# EAGLE design DRV8411A Module Rev. A (EAGLE 9.6.2)
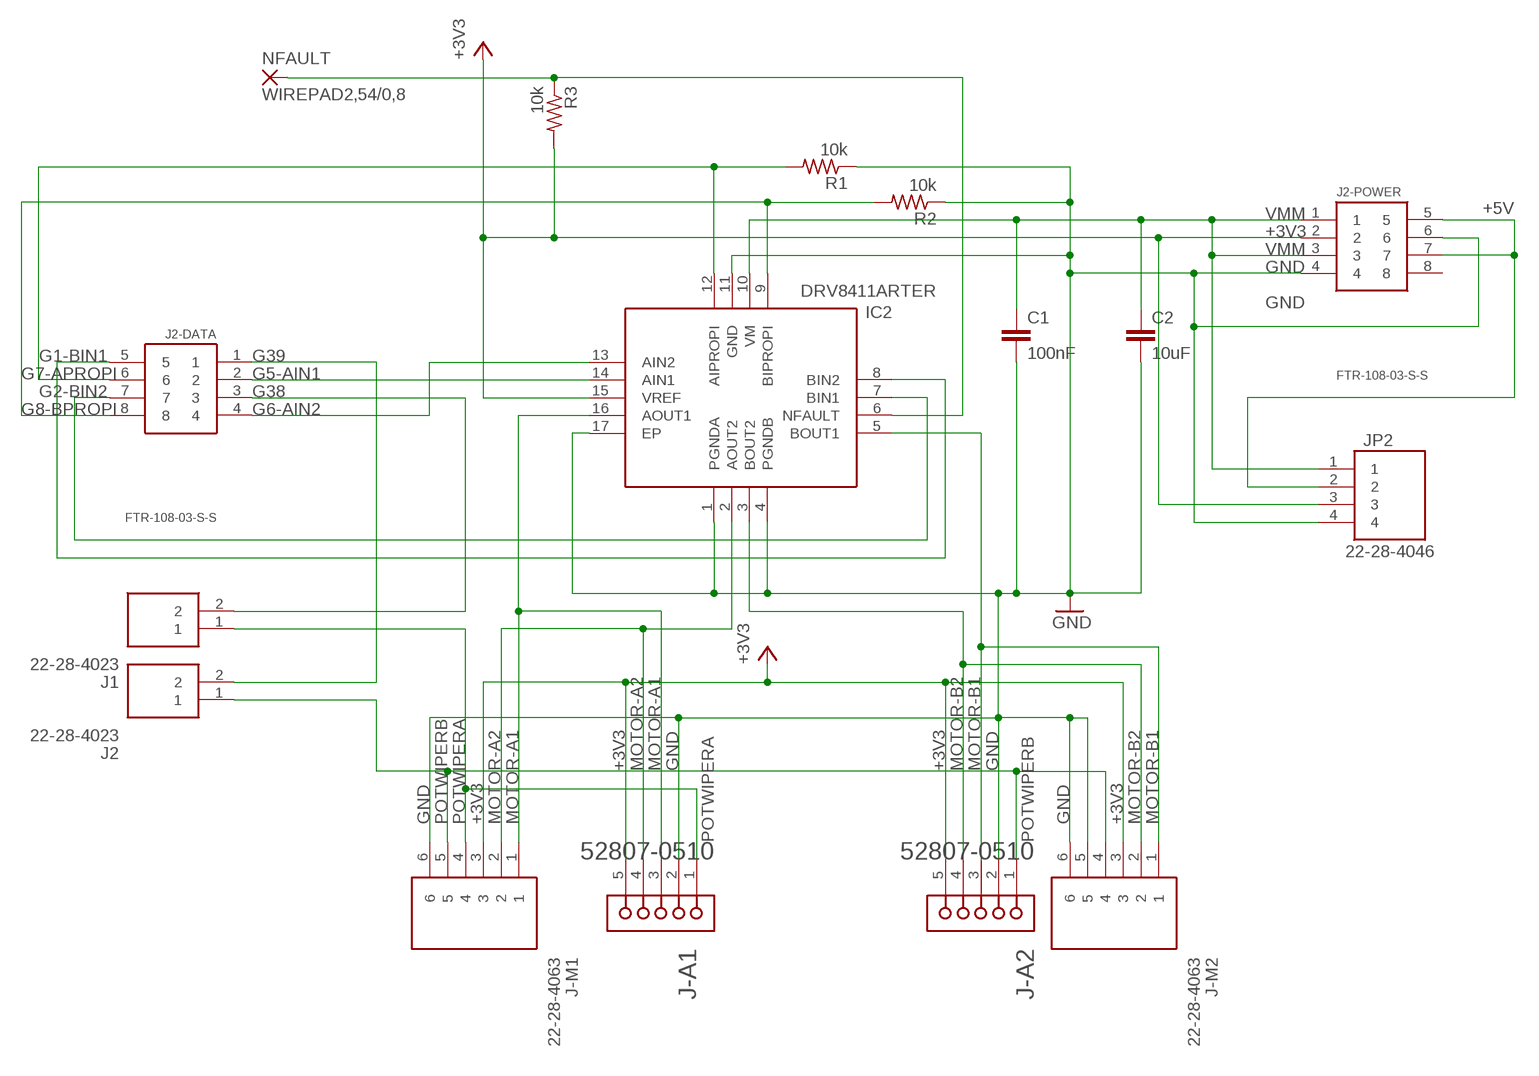
[diagram p0: schematic, sheet 1]

## Parts
C1  100nF  C-EUC0603  [C0603]
C2  10uF  C-EUC1206  [C1206]
IC2  DRV8411ARTER  [QFN50P300X300X80-17N]
J1  22-28-4023  [HDRV2W87P0X254_1X2_508X249X863]
J2  22-28-4023  [HDRV2W87P0X254_1X2_508X249X863]
J2-DATA  FTR-108-03-S-S  [HUSRSP8W46P127_1016X248X572P]
J2-POWER  FTR-108-03-S-S  [HUSRSP8W46P127_1016X248X572P]
J-A1  MOLEX_52807-0510MOLEX_52807-0510_0_0  [MOLEX_52807-0510_0]
J-A2  MOLEX_52807-0510MOLEX_52807-0510_0_0  [MOLEX_52807-0510_0]
J-M1  22-28-4063  [HDRV6W66P0X254_1X6_1524X249X83]
J-M2  22-28-4063  [HDRV6W66P0X254_1X6_1524X249X83]
JP2  22-28-4046  [HDRV4W66P0X254_1X4_1016X249X83]
NFAULT  WIREPAD2,54/0,8  [2,54/0,8]
R1  10k  R-US_R1206  [R1206]
R2  10k  R-US_R1206  [R1206]
R3  10k  R-US_R1206  [R1206]

## Nets
+3V3: IC2.15(VREF) J2-POWER.2 J-A1.5 J-A2.5 J-M1.3 J-M2.3 JP2.3 R3.2
+5V: J2-POWER.5 J2-POWER.7 JP2.2
G1-BIN1: IC2.8(BIN2) J2-DATA.5
G2-BIN2: IC2.7(BIN1) J2-DATA.7
G5-AIN1: IC2.14(AIN1) J2-DATA.2
G6-AIN2: IC2.13(AIN2) J2-DATA.4
G7-APROPI: IC2.12(AIPROPI) J2-DATA.6 R1.2
G8-BPROPI: IC2.9(BIPROPI) J2-DATA.8 R2.2
G38: J1.2 J2-DATA.3
G39: J2-DATA.1 J2.2
GND: C1.2 C2.2 IC2.1(PGNDA) IC2.4(PGNDB) IC2.11(GND) IC2.17(EP) J2-POWER.4 J2-POWER.6 J-A1.2 J-A2.2 J-M1.6 J-M2.5 J-M2.6 JP2.4 R1.1 R2.1
MOTOR-A1: IC2.16(AOUT1) J-A1.3 J-M1.1
MOTOR-A2: IC2.2(AOUT2) J-A1.4 J-M1.2
MOTOR-B1: IC2.5(BOUT1) J-A2.3 J-M2.1
MOTOR-B2: IC2.3(BOUT2) J-A2.4 J-M2.2
NFAULT: IC2.6(NFAULT) NFAULT.1(P) R3.1
POTWIPERA: J1.1 J-A1.1 J-M1.4
POTWIPERB: J2.1 J-A2.1 J-M1.5 J-M2.4
VMM [Power]: C1.1 C2.1 IC2.10(VM) J2-POWER.1 J2-POWER.3 JP2.1
Unconnected: J2-POWER.8

## Library data of the parts
C1 C2 = rcl:C-EU: CAPACITOR, European symbol; SPICEPREFIX: C
IC2 = SamacSys_Parts:DRV8411ARTER: Motor / Motion / Ignition Controllers & Drivers 1.65-V to 11-V, 4-A dual H-bridge motor driver with IPROPI current regulation Source: Datasheet <https://www.ti.com/product/DRV8411A/part-details/DRV8411ARTER>; DESCRIPTION: Motor / Motion / Ignition Controllers & Drivers 1.65-V to 11-V, 4-A dual H-bridge motor driver with IPROPI current regulation; HEIGHT: 0.8mm; MANUFACTURER_NAME: Texas Instruments; MANUFACTURER_PART_NUMBER: DRV8411ARTER; MOUSER_PART_NUMBER: 595-DRV8411ARTER; MOUSER_PRICE-STOCK: https://www.mouser.co.uk/ProductDetail/Texas-Instruments/DRV8411ARTER?qs=Jm2GQyTW%2FbhTQDH4ldRJVg%3D%3D
J1 J2 = SamacSys_Parts:22-28-4023: Molex KK 254 42375, 2.54mm Pitch, 2 Way, 1 Row Unshrouded, Straight Pin Header, Through Hole, Solder Termination Source: Datasheet <http://www.molex.com/molex/products/datasheet.jsp?part=active/0022284023_PCB_HEADERS.xml>; DESCRIPTION: Molex KK 254 42375, 2.54mm Pitch, 2 Way, 1 Row Unshrouded, Straight Pin Header, Through Hole, Solder Termination; HEIGHT: 8.63mm; MANUFACTURER_NAME: Molex; MANUFACTURER_PART_NUMBER: 22-28-4023; MOUSER_PART_NUMBER: 538-22-28-4023; MOUSER_PRICE-STOCK: https://www.mouser.co.uk/ProductDetail/Molex/22-28-4023?qs=MuwpYaHj750gid5X5P2KgQ%3D%3D
J2-DATA J2-POWER = SamacSys_Parts:FTR-108-03-S-S: CONN HEADER SMD 8 POS 1.27MM Source: Datasheet <http://suddendocs.samtec.com/catalog_english/ftr_smt.pdf>; DESCRIPTION: CONN HEADER SMD 8 POS 1.27MM; HEIGHT: mm; MANUFACTURER_NAME: SAMTEC; MANUFACTURER_PART_NUMBER: FTR-108-03-S-S
J-A1 J-A2 = Molex - 52807-0510:MOLEX_52807-0510: MOLX-52807-0510; CIIVA_IDS: 3407603; CIRCUITS_LOADED: 5; COMPONENT_LINK_1_DESCRIPTION: Manufacturer URL; COMPONENT_LINK_1_URL: http://www.molex.com/molex/index.jsp; COMPONENT_LINK_3_DESCRIPTION: Package Specification; COMPONENT_LINK_3_URL: http://www.molex.com/pdm_docs/sd/528070510_sd.pdf; CONTACT_POSITION: Top; CURRENT_MAX_PER_CONTACT: 0.2A, 0.4A, 0.5A; DATASHEET: http://www.molex.com/webdocs/datasheets/pdf/en-us/0528070510_FFC_FPC_CONNECTORS.pdf; ENTRY_ANGLE: 90degrees Angle; FOOTPRINT_VARIANT_NAME_0: Manufacturer Recommended; IMPORTED: yes; IMPORTED_FROM: vault; IMPORT_TS: 1521841804; MATED_HEIGHT: 3.60mm; MATERIAL___METAL: Phosphor Bronze; MATERIAL___PLATING_MATING: Tin; MATERIAL___PLATING_TERMINATION: Tin; MF: Molex; MOUNTING_TECHNOLOGY: Through Hole; MPN: 52807-0510; NUMBER_OF_ROWS: 1; ORIENTATION: Right Angle; PACKAGE: 52807-0510; PACKAGE_DESCRIPTION: 5-Lead FFC Connector, Pitch 1.0 mm; PACKAGE_VERSION: Rev. B, 08/2002; PACKING: Tray; PCB_RETENTION: None; PITCH___MATING_INTERFACE: 1.00mm; PITCH___TERMINATION_INTERFACE: 1.00mm; POLARIZED_TO_PCB: Yes; PREFIX: J; RELEASE_DATE: 1411372626; ROHS: Yes; STACKABLE: No; VAULT_GUID: C91CB896-1E32-4DB6-8F6C-FD3BFAFEC20D; VAULT_REVISION: BD038269-A002-43D0-B0A9-6B73FA1A6DCF; VOLTAGE_MAX: 50V
J-M1 J-M2 = SamacSys_Parts:22-28-4063: Headers & Wire Housings BREAKAWAY HDR VERT 6 Source: Datasheet <https://www.molex.com/pdm_docs/sd/022284063_sd.pdf>; DESCRIPTION: Headers & Wire Housings BREAKAWAY HDR VERT 6; HEIGHT: 8.38mm; MANUFACTURER_NAME: Molex; MANUFACTURER_PART_NUMBER: 22-28-4063; MOUSER_PART_NUMBER: 538-22-28-4063; MOUSER_PRICE-STOCK: https://www.mouser.co.uk/ProductDetail/Molex/22-28-4063?qs=MuwpYaHj750CQ%2FtWum2FiQ%3D%3D
JP2 = SamacSys_Parts:22-28-4046: Headers & Wire Housings 2.54MM HDR VT 4P 240/125 30AU Source: Datasheet <https://componentsearchengine.com/Datasheets/1/22-28-4046.pdf>; DESCRIPTION: Headers & Wire Housings 2.54MM HDR VT 4P 240/125 30AU; HEIGHT: 8.38mm; MANUFACTURER_NAME: Molex; MANUFACTURER_PART_NUMBER: 22-28-4046; MOUSER_PART_NUMBER: 538-22-28-4046; MOUSER_PRICE-STOCK: https://www.mouser.co.uk/ProductDetail/Molex/22-28-4046?qs=GAPJcf4kvdtZsXSzVDpHFw%3D%3D
NFAULT = wirepad:WIREPAD: Wire PAD connect wire on PCB
R1-R3 = rcl:R-US_: RESISTOR, American symbol; SPICEPREFIX: R

## Net classes
2 Power: width 0.203 mm

## Board
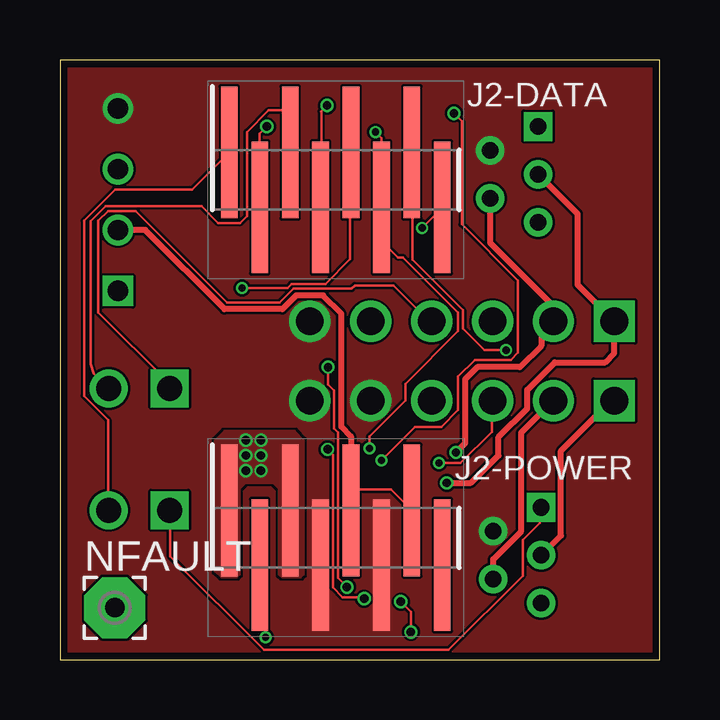
[diagram p1: board, top side]
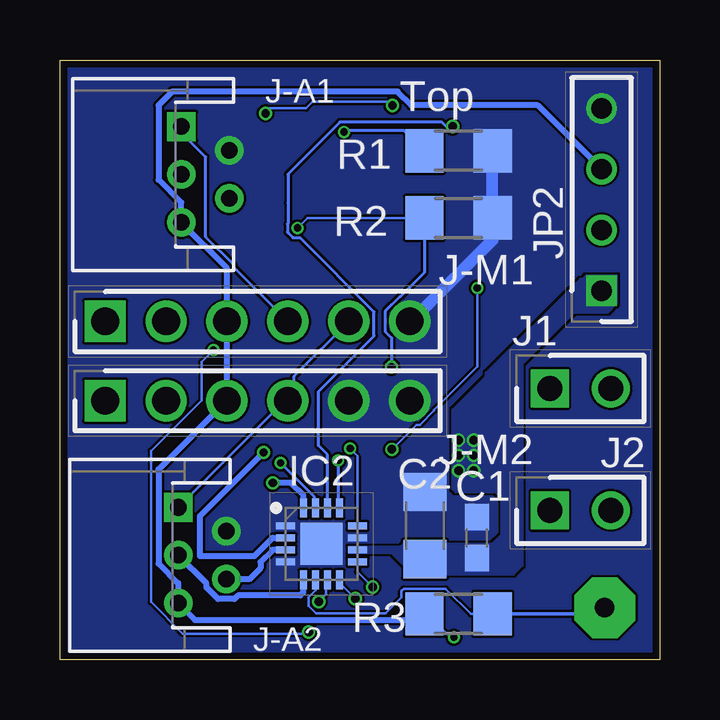
[diagram p2: board, bottom side, seen from below]

Size 25 x 25 mm. Coordinates in mm from the lower left corner, seen from the top.
Outline: 0,0 25,0 25,25 0,25 0,0
Copper layers (1*16): Top 0.035mm / dielectric 1.5mm / Bottom 0.035mm
Design rules "PCBWay_2L_100um-Track": minimum track width 0.1mm, minimum drill 0.3mm, track to track 0.1mm, track to pad 0.1mm, pad to pad 0.1mm, via to via 0.1mm, smd to smd 0mil, copper to edge 0.3mm, drill to drill 10mil, minimum pad ring 6mil, minimum via ring 0.1mm, stop-mask expansion 2mil, vias tented up to drill 0.45mm, thermal gap 0.2mm

### Footprints (pad centres in the part's own frame; a part is rotated, then mirrored left to right if it is on the bottom)
C0603 = smd 1.1 x 1: 1 -0.85,0; 2 0.85,0
C1206 = smd 1.6 x 1.8: 1 -1.4,0; 2 1.4,0
QFN50P300X300X80-17N = smd 0.8 x 0.3: 1 -1.5,0.75; 2 -1.5,0.25; 3 -1.5,-0.25; 4 -1.5,-0.75; 9 1.5,-0.75; 10 1.5,-0.25; 11 1.5,0.25; 12 1.5,0.75 | smd 0.3 x 0.8: 5 -0.75,-1.5; 6 -0.25,-1.5; 7 0.25,-1.5; 8 0.75,-1.5; 13 0.75,1.5; 14 0.25,1.5; 15 -0.25,1.5; 16 -0.75,1.5 | smd 1.76 x 1.76: 17 0,0
HDRV2W87P0X254_1X2_508X249X863 = drill 1.05 pad 1.575 square: 1 0,0 | drill 1.05 pad 1.575: 2 2.54,0
HUSRSP8W46P127_1016X248X572P = smd 0.69 x 5.49: 1 -4.445,1.142; 2 -3.175,-1.142; 3 -1.905,1.142; 4 -0.635,-1.142; 5 0.635,1.142; 6 1.905,-1.142; 7 3.175,1.142; 8 4.445,-1.142
MOLEX_52807-0510_0 = drill 0.7 pad 1.2 square: 1 0,0 | drill 0.7 pad 1.2: 2 1,2; 3 2,0; 4 3,2; 5 4,0
HDRV6W66P0X254_1X6_1524X249X83 = drill 1.15 pad 1.725 square: 1 0,0 | drill 1.15 pad 1.725: 2 2.54,0; 3 5.08,0; 4 7.62,0; 5 10.16,0; 6 12.7,0
HDRV4W66P0X254_1X4_1016X249X83 = drill 0.85 pad 1.275 square: 1 0,0 | drill 0.85 pad 1.275: 2 2.54,0; 3 5.08,0; 4 7.62,0
2,54/0,8 = drill 0.813 pad 2.54 octagon: 1 0,0
R1206 = smd 1.6 x 1.803: 1 -1.422,0; 2 1.422,0

### Placement (x,y rotation side)
C1  7.62,5.08 90 bottom
C2  9.78,5.59 90 bottom
IC2  14.1,4.83 0 bottom
J1  4.57,11.3 0 bottom
J2  4.57,6.22 0 bottom
J2-DATA  11.5,20 0 top
J2-POWER  11.5,5.08 0 top
J-A1  19.94,22.23 270 bottom
J-A2  20.07,6.35 270 bottom
J-M1  23.11,14.1 0 bottom
J-M2  23.11,10.79 0 bottom
JP2  2.41,15.37 90 bottom
NFAULT  2.29,2.16 0 top
R1  8.38,21.21 180 bottom
R2  8.38,18.41 180 bottom
R3  8.38,1.91 180 bottom

### Tracks (layer width: path | path; a pad name or v marks a point on that pad's centre or on a via)
+3V3  (via drill 0.3)
  Top 0.1: v15.8,8.2 16.7,8.2 18,9.5 18,10.7 J-M2.3 | v8.57,0.93 8.57,3.73 8.4,3.9 J2-POWER.2
  Bottom 0.1: 14.4,6.4 IC2.15 | v8.57,0.93 8.73,0.93 9.7,1.9 R3.2
  Bottom 0.127: 14.4,6.4 14.4,6.8 v15.8,8.2
  Bottom 0.254: R3.2 10.06,1.65 19.37,1.65 J-A2.5 20.07,3.18 20.89,4.01 20.89,7.94 J-M2.3 J-M1.3 18.03,16.32 J-A1.5 19.94,19.05 20.89,20.01 20.89,23.11 20.32,23.69 10.92,23.69 10.35,23.11 5.08,23.11 JP2.3
+5V
  Top 0.1: J2-POWER.7 14.6,6.3 13.8,7.1 12.2,7.1 J2-POWER.5
  Top 0.254: JP2.2 3.56,17.91 6.86,14.61 9.27,14.61 9.85,15.19 10.98,15.19 11.74,14.43 11.74,9.71 12.13,9.31 J2-POWER.5
G1-BIN1  (via drill 0.3, 0.35)
  Top 0.1: J2-DATA.5 12.1,21.1 12.1,16.7 11.06,15.66 9.65,15.66 9.48,15.49 v7.6,15.49 | v12.69,2.54 12.62,2.6 11.79,2.6 11.38,3 11.38,8.54 v11.16,8.76
  Bottom 0.1: IC2.8 13.35,3.2 v12.69,2.54 | v11.16,8.76 10.14,9.78 9.99,9.78 9.4,10.38 9.4,10.41 7.6,12.21 v7.6,15.49
G2-BIN2  (via drill 0.3, 0.35)
  Top 0.1: v18.6,12.9 17.7,12.9 16.8,13.8 16.8,14.57 14.7,16.67 14.7,21.1 J2-DATA.7 | v14.21,2.41 14.63,1.99 v14.63,1.15
  Bottom 0.1: v18.6,12.9 19.1,12.4 19.1,10.8 21.2,8.7 21.2,2.4 19.88,1.08 14.7,1.08 v14.63,1.15 | v14.21,2.41 13.9,2.72 13.9,3.27 IC2.7
G5-AIN1  (via drill 0.35)
  Top 0.1: J2-DATA.2 8.32,21.92 v8.63,22.23
  Bottom 0.1: 15.5,17.8 15.5,19.05
  Bottom 0.127: IC2.14 13.85,8.55 14.22,8.92 14.22,11.18 11.9,13.5 11.9,14.5 14.99,17.59 15,17.59 15.24,17.59 15.29,17.59 15.5,17.8 15.5,17.82 15.51,17.83 15.51,18.17 15.5,18.18 15.5,19.05 15.5,20.24 13.32,22.41 9.08,22.41 8.89,22.23 v8.63,22.23
G6-AIN2  (via drill 0.3, 0.35)
  Top 0.1: v13.4,8.3 14.8,9.7 15.9,9.7 16.6,10.4 16.6,11.8 17.3,12.5 18.8,12.5 19.1,12.8 19.1,15.8 16.75,18.15 16.75,22.45 v16.43,22.77 | J2-DATA.4 10.9,18.9 10.9,22.83 10.88,22.85 v11.14,23.1
  Bottom 0.1: 13.4,6.4 IC2.13 | v11.14,23.1 11.29,23.26 14.46,23.26 14.73,22.99 16.26,22.99 16.43,22.82 v16.43,22.77
  Bottom 0.127: v13.4,8.3 13.4,6.4
G7-APROPI  (via drill 0.3)
  Top 0.1: v12.9,8.8 12.9,9.3 14.4,10.8 14.4,11.5 16.6,13.7 16.6,14.47 14.31,16.76 14.1,16.76 13.4,17.46 J2-DATA.6 13.41,21.75 v13.15,22
  Bottom 0.1: v12.9,8.8 12.6,8.5 12.6,5.6 IC2.12
  Bottom 0.127: R1.2 10.66,22.06 13.09,22.06 v13.15,22
G8-BPROPI  (via drill 0.3, 0.35)
  Top 0.1: v15.1,18 15.9,18.8 J2-DATA.8 | v11.97,3.02 11.59,3.41 11.59,9.47 11.43,9.63 11.43,11.21 11.18,11.46 v11.18,12.19
  Bottom 0.1: IC2.9 12.6,3.66 v11.97,3.02 | v11.18,12.19 11.18,13.43 11.43,13.68 11.43,14.52 9.8,16.14 | R2.2 14.69,18.41 v15.1,18
  Bottom 0.127: R2.2 9.8,16.14 10.82,15.12 10.84,15.12 11.44,14.52 11.44,13.67 11.18,13.41 v11.18,12.19
G38
  Top 0.1: J1.2 1.4,11.93 1.27,12.33 1.27,18.27 1.9,18.9 5.9,18.9 6.6,18.2 7.5,18.2 7.8,18.5 7.8,22 8.71,22.9 9.56,22.9 9.56,21.18 J2-DATA.3
G39
  Top 0.1: J2.2 2,6.3 2,10 1,11 1,18.3 2.3,19.6 5.5,19.6 7,21.1 J2-DATA.1
GND
  Bottom 0.508: R1.1 R2.1 6.96,17.49 10.36,14.1 J-M1.6
  pour Bottom (no thermals): 13.08,5.21 13.21,5.33 13.21,5.71 17.14,5.71 17.53,6.1 18.54,6.1 18.8,5.84 18.8,4.95 18.54,4.7 17.4,4.7 16.76,5.33 16.38,5.33 16.26,5.46 14.99,5.46 14.99,4.32 15.11,4.19 16,4.19 16,3.94 13.34,3.94 13.21,4.06 13.21,4.83 13.08,4.95
  pour Top (no thermals): 10.41,6.6 10.67,6.86 11.3,6.86 11.3,2.54 12.19,1.65 12.83,2.29 12.83,6.6 13.08,6.86 13.72,6.86 13.97,6.6 13.97,0.89 13.84,0.76 10.67,0.76 10.41,1.02
  pour Top (no thermals): 9.78,14.86 10.79,14.86 11.3,14.35 11.3,11.56 11.43,11.43 11.43,6.35 10.41,6.35 10.41,9.65 9.27,10.79 9.27,14.35
  pour Bottom (rank 3, no thermals): 0.25,24.77 24.77,24.77 24.77,0.25 24.64,0.13 0.13,0.13 0.13,24.64
  pour Top (rank 3, no thermals): 0.38,24.77 24.77,24.77 24.89,24.64 24.89,0.38 24.77,0.25 0.38,0.25 0.25,0.38 0.25,24.64
MOTOR-A1  (via drill 0.35)
  Top 0.254: v16.13,7.37 17.14,7.37 18.29,8.51 18.29,9.27 19.48,10.47 19.48,11.25 20.63,12.39 22.73,12.39 23.11,12.77 J-M1.1 21.59,15.62 21.59,18.57 J-A1.3
  Bottom 0.254: IC2.16 14.85,6.83 15.38,7.37 v16.13,7.37
MOTOR-A2  (via drill 0.35)
  Top 0.254: v16.51,8.64 16.89,9.02 16.89,11.68 17.4,12.19 19.18,12.19 20.07,13.08 20.07,13.59 J-M1.2 20.57,14.73 17.94,17.37 J-A1.4
  Bottom 0.254: v16.51,8.64 17.02,8.13 19.18,5.97 19.18,4.32 16.89,4.32 16.13,5.08 IC2.2
MOTOR-B1
  Top 0.254: J-A2.3 20.89,5.18 20.89,8.7 22.99,10.79 J-M2.1
  Bottom 0.254: IC2.5 14.86,3.31 14.86,2.79 14.99,2.67 17.58,2.67 17.72,2.52 18.41,2.52 18.89,3.01 18.89,3.18 J-A2.3
MOTOR-B2
  Top 0.254: J-A2.4 18.07,4.18 19.24,5.35 19.24,9.46 J-M2.2
  Bottom 0.254: IC2.3 16.12,4.58 16.64,4.06 16.64,3.81 17.1,3.35 J-A2.4
NFAULT
  Bottom 0.1: IC2.6 14.35,2.88 14.63,2.59 14.63,2.24 14.32,1.93 11.43,1.93 10.75,2.6 10.75,2.87 10.67,2.96 8.93,2.96 7.87,1.91 R3.1
  Bottom 0.152: R3.1 2.54,1.91 NFAULT.1
POTWIPERA
  Top 0.1: J1.1 4.5,11.4 4.5,11.57 1.6,14.47 1.6,18.3 2,18.7 3.16,18.7 6.97,14.88 9.16,14.88 9.74,15.46 12.16,15.46 12.3,15.6 13.9,15.6 15.4,14.1 J-M1.4
  Bottom 0.127: J-M1.4 17.74,16.35 17.74,16.44 18.92,17.62 18.92,20.95 19.94,21.97 J-A1.1
POTWIPERB
  Top 0.1: J2.1 4.6,6.2 4.6,4.3 8.5,0.4 16.2,0.4 19.3,3.5 19.3,5 20,5.7 20,6.3 J-A2.1
  Bottom 0.127: J-M1.5 15.23,11.82 15.23,11.06 J-M2.4 15.62,10.79 J-A2.1
VMM  (via drill 0.35)
  other vias: 8.38,7.87 7.75,7.87 7.75,8.51 8.38,8.51 8.38,9.14 7.75,9.14
  pour Bottom (no thermals): 6.99,4.83 10.67,4.83 10.79,4.7 12.95,4.7 12.95,4.45 11.18,4.45 10.29,3.56 6.1,3.56 5.71,3.94 5.71,12.32 3.56,14.48 2.16,14.48 1.78,14.86 1.78,16 3.05,16 3.17,15.88 3.3,15.88 7.24,11.94 7.24,11.81 8.64,10.41 8.64,7.11 8.51,6.99 6.86,6.99 6.6,6.73 6.6,5.21
  pour Top (rank 2, no thermals): 6.86,9.53 9.78,9.53 10.16,9.14 10.16,3.56 10.03,3.43 9.27,3.43 9.14,3.56 9.14,7.11 8.89,7.37 7.75,7.37 7.49,7.11 7.49,3.56 7.37,3.43 6.73,3.43 6.48,3.68 6.48,9.14

### Text on the board
bNames: ⇦ Top